# EAGLE schematic Snake (EAGLE 9.6.2)
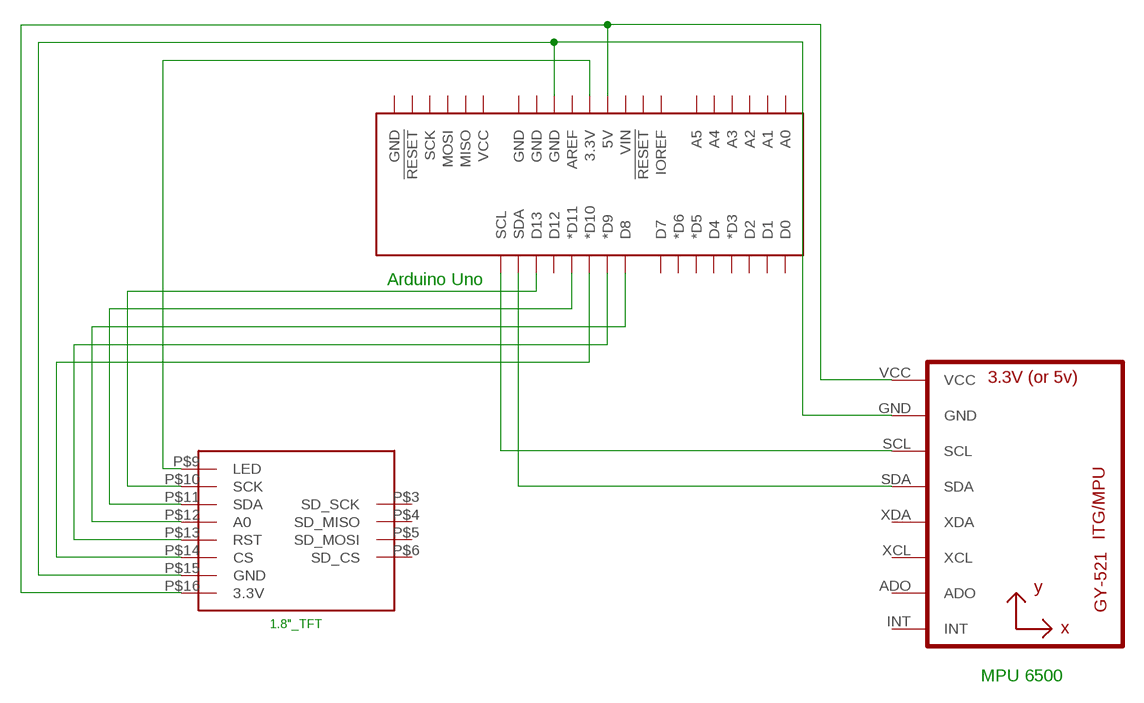
[diagram p0: schematic, sheet 1]

## Parts
B1  ARDUINO_UNO_R3NO_HOLES  [ARDUINO_R3_NO_HOLES]
U1  GY-521MPU6050  [GY-521]
U$1  1.8"_TFT  [1.8"_TFT]

## Nets
N$1: B1.3.3V U$1.P$9(LED)
N$2: B1.D13 U$1.P$10(SCK)
N$3: B1.D11(*D11) U$1.P$11(SDA)
N$4: B1.D8 U$1.P$12(A0)
N$5: B1.D9(*D9) U$1.P$13(RST)
N$6: B1.D10(*D10) U$1.P$14(CS)
N$7: B1.GND@4(GND) U1.GND U$1.P$15(GND)
N$8: B1.5V U1.VCC U$1.P$16(3.3V)
N$9: B1.SDA U1.SDA
N$10: B1.SCL U1.SCL
Unconnected: B1.A0 B1.A1 B1.A2 B1.A3 B1.A4 B1.A5 B1.AREF B1.D0 B1.D1 B1.D2 B1.D3(*D3) B1.D4 B1.D5(*D5) B1.D6(*D6) B1.D7 B1.D12 B1.GND@1(GND) B1.GND@2(GND) B1.GND@3(GND) B1.IOREF B1.MISO B1.MOSI B1.RESET@1(!RESET!) B1.RESET@2(!RESET!) B1.SCK B1.VCC B1.VIN U1.ADO U1.INT U1.XCL U1.XDA U$1.P$3(SD_SCK) U$1.P$4(SD_MISO) U$1.P$5(SD_MOSI) U$1.P$6(SD_CS)

## Notes on the sheet
- Arduino Uno
- MPU 6500

## Library data of the parts
B1 = SparkFun-Boards:ARDUINO_UNO_R3: Arduino R3 Footprint with SPI header Arduino Uno R3 Compatible Footprint. Matches PCB size of the original board. SparkFun Products: SAMD21 Dev Breakout <https://www.sparkfun.com/products/13672> RedBoard <https://www.sparkfun.com/products/12757> R3 Stackable Headers <https://www.sparkfun.com/products/11417>
U1 = gy-521:GY-521
U$1 = tft_1.8_1.44_oled_0.96:1.8"_TFT